# Altium project GB-Drone_master.PrjPcb
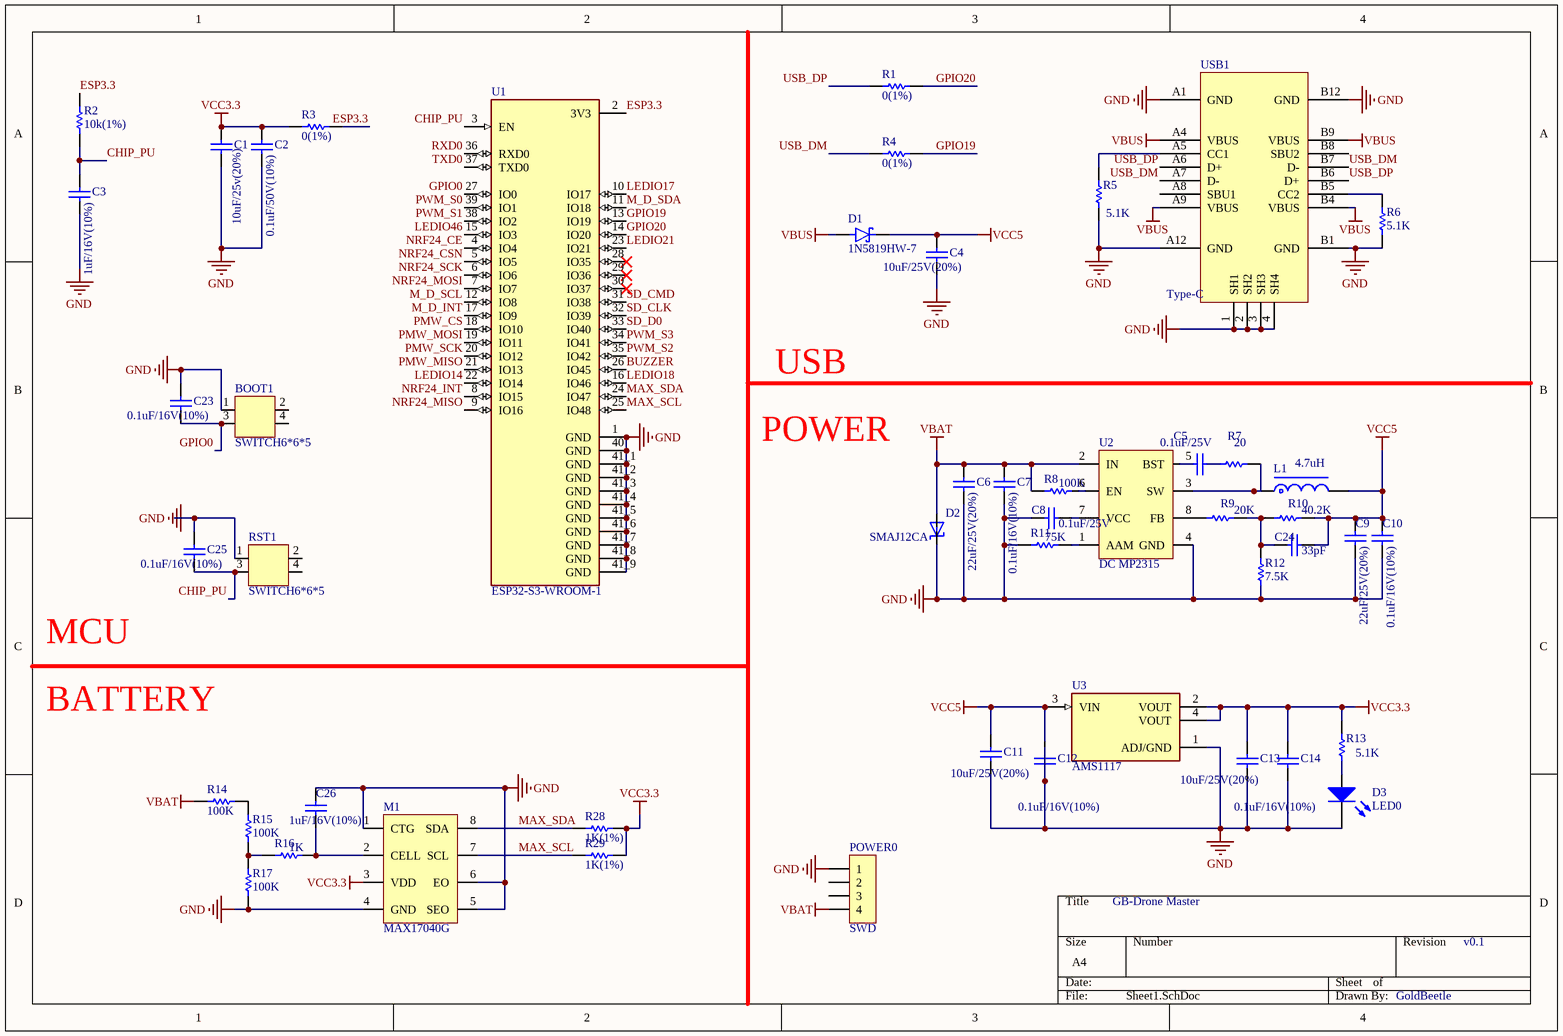
[diagram p0: Sheet1.SchDoc]
2 sheets, 82 parts. Net scope: global (net labels, ports and power ports of the same name join across sheets).
Board file: PCB1.PcbDoc
Sheets:
  Sheet1.SchDoc
  Sheet2.SchDoc

## Sheet Sheet1.SchDoc
size A4; SheetNumber: 1; SheetTotal: 2

### Parts
BOOT1  SWITCH6*6*5
C1  10uF/25v(20%)  [C0805]
C2  0.1uF/50V(10%)  [C0805]
C3  value 1uF/16V(10%)  [C0805]  (hidden comment: 0.1uF/50V(10%))
C4  10uF/25V(20%)  [C0805]
C5  0.1uF/25V  [C0805]
C6  22uF/25V(20%)  [C0805]
C7  0.1uF/16V(10%)  [C0805]
C8  0.1uF/25V  [C0805]
C9  22uF/25V(20%)  [C0805]
C10  0.1uF/16V(10%)  [C0805]
C11  10uF/25V(20%)  [C0805]
C12  0.1uF/16V(10%)  [C0805]
C13  10uF/25V(20%)  [C0805]
C14  0.1uF/16V(10%)  [C0805]
C23  0.1uF/16V(10%)  [C0805]
C24  33pF  [C0805]
C25  0.1uF/16V(10%)  [C0805]
C26  1uF/16V(10%)  [C0805]
D1  1N5819HW-7  [SOD3715X145N]
D2  SMAJ12CA  [DO-214AC]
D3  LED0  [C0805]
L1  4.7uH  [C0805]
M1  MAX17040G  [SON50P200X300X80-9N(MAX27040G+T)]
POWER0  SWD  [XH2.54-4P]
R1  0(1%)  [C0805]
R2  10k(1%)  [C0805]
R3  0(1%)  [C0805]
R4  0(1%)  [C0805]
R5  5.1K  [C0805]
R6  5.1K  [C0805]
R7  20  [C0805]
R8  100K  [C0805]
R9  20K  [C0805]
R10  40.2K  [C0805]
R11  75K  [C0805]
R12  7.5K  [C0805]
R13  5.1K  [C0805]
R14  100K  [C0805]
R15  100K  [C0805]
R16  1K  [C0805]
R17  100K  [C0805]
R28  1K(1%)  [C0805]
R29  1K(1%)  [C0805]
RST1  SWITCH6*6*5
U1  ESP32-S3-WROOM-1  [ESP32-S3-WROOM-1-N16R8]
U2  DC MP2315  [SOT23-8L]
U3  AMS1117  [SOT229P700X180-4N]
USB1  Type-C  [Type-C-TOP]

### Nets
ESP3.3: R2.2 R3.2 U1.2(3V3)
GND: BOOT1.1 C1.1 C2.1 C3.1 C4.1 C6.1 C7.1 C8.1 C9.1 C10.1 C11.1 C12.1 C13.1 C14.1 C23.1 C25.1 C26.2 D2.C D3.2(K) M1.1(CTG) M1.4(GND) M1.5(SEO) M1.6(EO) POWER0.1 R5.1 R6.1 R11.1 R12.2 R17.1 RST1.1 U1.1(GND) U1.40(GND) U1.41_1(GND) U1.41_2(GND) U1.41_3(GND) U1.41_4(GND) U1.41_5(GND) U1.41_6(GND) U1.41_7(GND) U1.41_8(GND) U1.41_9(GND) U2.4(GND) U3.1(ADJ/GND) USB1.1(SH1) USB1.2(SH2) USB1.3(SH3) USB1.4(SH4) USB1.A1(GND) USB1.A12(GND) USB1.B1(GND) USB1.B12(GND)
VBAT: C6.2 C7.2 D2.A POWER0.4 R8.1 R14.2 U2.2(IN)
VBUS: D1.A USB1.A4(VBUS) USB1.A9(VBUS) USB1.B4(VBUS) USB1.B9(VBUS)
VCC3.3: C1.2 C2.2 C13.2 C14.2 M1.3(VDD) R3.1 R13.1 R28.2 R29.2 U3.2(VOUT) U3.4(VOUT)
VCC5: C4.2 C9.2 C10.2 C11.2 C12.2 C24.2 D1.C(K) L1.2 R10.2 U3.3(VIN)
BUZZER: U1.26(IO45)
CHIP_PU: C3.2 C25.2 R2.1 RST1.3 U1.3(EN)
GPIO0: BOOT1.3 C23.2 U1.27(IO0)
GPIO19: R4.2 U1.13(IO19)
GPIO20: R1.2 U1.14(IO20)
LEDIO14: U1.22(IO14)
LEDIO17: U1.10(IO17)
LEDIO18: U1.16(IO46)
LEDIO21: U1.23(IO21)
LEDIO46: U1.15(IO3)
M_D_INT: U1.17(IO9)
M_D_SCL: U1.12(IO8)
M_D_SDA: U1.11(IO18)
MAX_SCL: M1.7(SCL) R29.1 U1.25(IO48)
MAX_SDA: M1.8(SDA) R28.1 U1.24(IO47)
NRF24_CE: U1.4(IO4)
NRF24_CSN: U1.5(IO5)
NRF24_INT: U1.8(IO15)
NRF24_MISO: U1.9(IO16)
NRF24_MOSI: U1.7(IO7)
NRF24_SCK: U1.6(IO6)
PMW_CS: U1.18(IO10)
PMW_MISO: U1.21(IO13)
PMW_MOSI: U1.19(IO11)
PMW_SCK: U1.20(IO12)
PWM_S0: U1.39(IO1)
PWM_S1: U1.38(IO2)
PWM_S2: U1.35(IO42)
PWM_S3: U1.34(IO41)
RXD0: U1.36(RXD0)
SD_CLK: U1.32(IO39)
SD_CMD: U1.31(IO38)
SD_D0: U1.33(IO40)
TXD0: U1.37(TXD0)
USB_DM: R4.1 USB1.A7(D-) USB1.B7(D-)
USB_DP: R1.1 USB1.A6(D+) USB1.B6(D+)
NetC5_1: C5.1 U2.5(BST)
NetC5_2: C5.2 R7.1
NetC8_2: C8.2 U2.7(VCC)
NetC24_1: C24.1 R9.2 R10.1 R12.1
NetC26_1: C26.1 M1.2(CELL) R16.2
NetD3_1: D3.1(A) R13.2
NetL1_1: L1.1 R7.2 U2.3(SW)
NetR5_2: R5.2 USB1.A5(CC1)
NetR6_2: R6.2 USB1.B5(CC2)
NetR8_2: R8.2 U2.6(EN)
NetR9_1: R9.1 U2.8(FB)
NetR11_2: R11.2 U2.1(AAM)
NetR14_1: R14.1 R15.2
NetR15_1: R15.1 R16.1 R17.2

Not connected (* = marked no-connect by the designer): BOOT1 2 4; POWER0 2 3; RST1 2 4; U1 28(IO35)* 29(IO36)* 30(IO37)*; USB1 A8(SBU1) B8(SBU2)

### Notes on the sheet
- USB
- POWER
- MCU
- BATTERY
- GB-Drone Master
- v0.1
- GoldBeetle

### Library data of the parts
C1-C14 C23-C26 = Cap: Capacitor; Published: 8-Jun-2000; LatestRevisionDate: 17-Jul-2002; LatestRevisionNote: Re-released for DXP Platform.; PackageReference: RAD-0.3; Publisher: Altium Limited; PackageDescription: Radial Cap, Thru-Hole; 2 Leads; 0.3 in Pin Spacing
  C1: Value: 10uF/25v(20%)
  C2: Value: 0.1uF/50V(10%)
D1 = 1N5819HW-7: Diode Schottky 40 V 1A Surface Mount SOD-123; MF: Diodes Inc.; SnapEDA_Link: https://www.snapeda.com/parts/1N5819HW-7/Diodes+Inc./view-part/?ref=snap; Price: None; Check_prices: https://www.snapeda.com/parts/1N5819HW-7/Diodes+Inc./view-part/?ref=eda; Availability: In Stock; Value: *; MP: 1N5819HW-7; Package: SOD-123 Fairchild Semiconductor; Purchase-URL: https://pricing.snapeda.com/search/part/1N5819HW-7/?ref=eda
D2 = SMAJ12CA: 19.9V Clamp 20.1A Ipp Tvs Diode Surface Mount SMAJ _DO-214AC_; MF: Taiwan Semiconductor; SnapEDA_Link: https://www.snapeda.com/parts/SMAJ12CA/Taiwan%20Semiconductor/view-part/2769109/?ref=snap; Availability: Unavailable; Value: *; MP: SMAJ12CA; Package: DO-214AC-214 Taiwan Semiconductor; Price: None
D3 = LED0: Typical INFRARED GaAs LED; Published: 8-Jun-2000; LatestRevisionDate: 08-Jul-2005; LatestRevisionNote: Mech Layer 1 removed.; PackageReference: LED-0; Publisher: Altium Limited; PackageDescription: LED; 2 Leads
L1 = L-NR: NR功率电感; 版权归属: 源创客; BOM名称: NR功率电感; 学习资源: www.ooocke.com
M1 = MAX17040G: 电量检测
POWER0 = Header 4: 4P接插件; 版权归属: 源创客; BOM名称: 4P接插件; 学习资源: www.ooocke.com
R1-R17 R28 R29 = Res1: Resistor; Published: 8-Jun-2000; LatestRevisionDate: 17-Jul-2002; LatestRevisionNote: Re-released for DXP Platform.; PackageReference: AXIAL-0.3; Publisher: Altium Limited; PackageDescription: Axial Device, Thru-Hole; 2 Leads; 0.3 in Pin Spacing
U1 = ESP32-S3-WROOM-1: Bluetooth, WiFi 802.11b/g/n, Bluetooth v5.0 Transceiver Module 2.4GHz PCB Trace Surface Mount; MP: ESP32-S3-WROOM-1-N8R8; MF: Espressif Systems; Price: None; Availability: In Stock; Package: None; Value: *; SnapEDA_Link: https://www.snapeda.com/parts/ESP32-S3-WROOM-1-N8R8/Espressif+Systems/view-part/?ref=snap; Check_prices: https://www.snapeda.com/parts/ESP32-S3-WROOM-1-N8R8/Espressif+Systems/view-part/?ref=eda; Purchase-URL: https://pricing.snapeda.com/search/part/ESP32-S3-WROOM-1-N8R8/?ref=eda
U2 = DC MP2315: DC降压芯片
U3 = AMS1117: UNO PLUS Arduino R3 Shield, Xbee Arduino IDE Wheeled Robotics Kit; MF: Seeed Technology; Availability: Unavailable; SnapEDA_Link: https://www.snapeda.com/parts/AMS1117/Seeed%20Technology%20Co.%2C%20Ltd/view-part/184428/?ref=snap; MP: AMS1117; Price: None; Value: *; Package: SOT-223 Seeed Technology
USB1 = USB-Type-C-TOP

## Sheet Sheet2.SchDoc
size A4; SheetNumber: 2; SheetTotal: 2
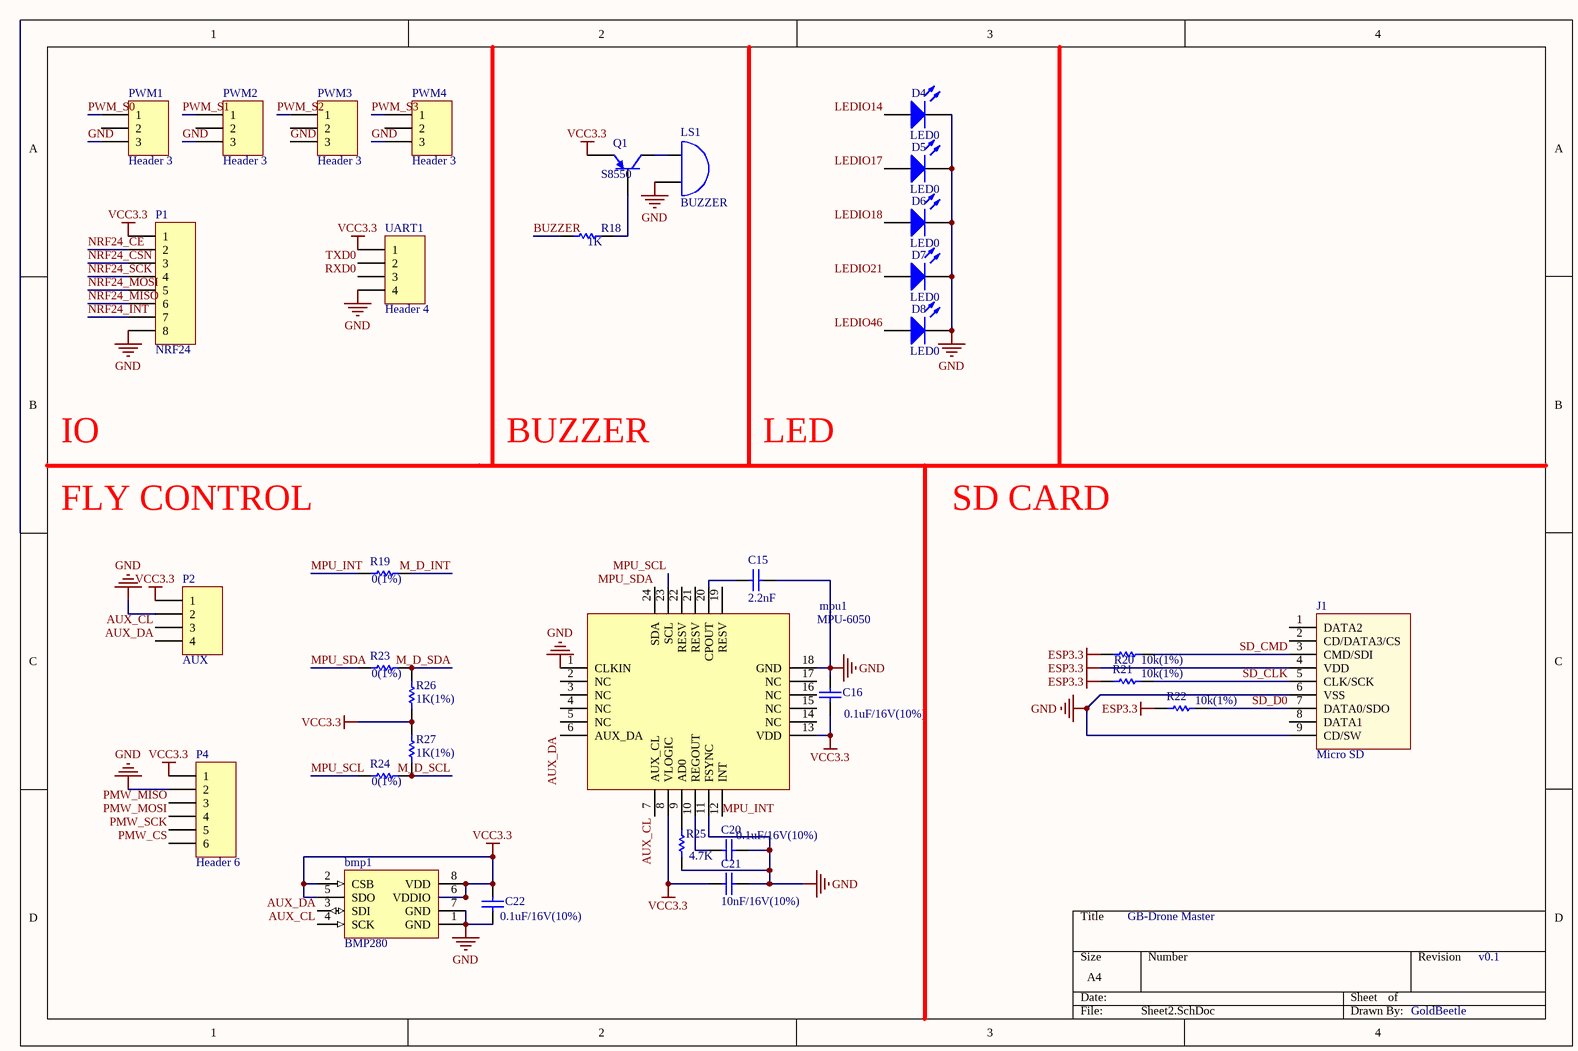
[diagram p1: Sheet2.SchDoc]

### Parts
bmp1  BMP280  [BMP280 LGA8]
C15  2.2nF  [C0805]
C16  0.1uF/16V(10%)  [C0805]
C20  0.1uF/16V(10%)  [C0805]
C21  10nF/16V(10%)  [C0805]
C22  0.1uF/16V(10%)  [C0805]
D4  LED0  [C0805]
D5  LED0  [C0805]
D6  LED0  [C0805]
D7  LED0  [C0805]
D8  LED0  [C0805]
J1  Micro SD  [Micro SD]
LS1  BUZZER  [Beeper]
mpu1  MPU-6050  [QFN24 4X4_N]
P1  NRF24  [NRF24_line]
P2  AUX  [XH2.54-4P]
P4  Header 6  [XH2.54-6P]
PWM1  Header 3  [HDR1X3]
PWM2  Header 3  [HDR1X3]
PWM3  Header 3  [HDR1X3]
PWM4  Header 3  [HDR1X3]
Q1  S8550  [SOT-23B_N]
R18  1K  [C0805]
R19  0(1%)  [C0805]
R20  10k(1%)  [C0805]
R21  10k(1%)  [C0805]
R22  10k(1%)  [C0805]
R23  0(1%)  [C0805]
R24  0(1%)  [C0805]
R25  4.7K  [C0805]
R26  1K(1%)  [C0805]
R27  1K(1%)  [C0805]
UART1  Header 4  [HDR1X4]

### Nets
ESP3.3: J1.4(VDD) R20.2 R21.2 R22.2
GND: bmp1.1(GND) bmp1.7(GND) C15.1 C16.1 C20.1 C21.1 C22.2 D4.2(K) D5.2(K) D6.2(K) D7.2(K) D8.2(K) J1.6(VSS) J1.9(CD/SW) LS1.2(B) mpu1.1(CLKIN) mpu1.11(FSYNC) mpu1.18(GND) P1.8 P2.2 P4.2 PWM1.3 PWM2.3 PWM3.3 PWM4.3 R25.2 UART1.4
VCC3.3: bmp1.2(CSB) bmp1.5(SDO) bmp1.6(VDDIO) bmp1.8(VDD) C16.2 C21.2 C22.1 mpu1.8(VLOGIC) mpu1.13(VDD) P1.1 P2.1 P4.1 Q1.2(E) R26.1 R27.2 UART1.1
AUX_CL: bmp1.4(SCK) mpu1.7(AUX_CL) P2.3
AUX_DA: bmp1.3(SDI) mpu1.6(AUX_DA) P2.4
BUZZER: R18.1
LEDIO14: D4.1(A)
LEDIO17: D5.1(A)
LEDIO18: D6.1(A)
LEDIO21: D7.1(A)
LEDIO46: D8.1(A)
M_D_INT: R19.2
M_D_SCL: R24.2 R27.1
M_D_SDA: R23.2 R26.2
MPU_INT: mpu1.12(INT) R19.1
MPU_SCL: mpu1.23(SCL) R24.1
MPU_SDA: mpu1.24(SDA) R23.1
NRF24_CE: P1.2
NRF24_CSN: P1.3
NRF24_INT: P1.7
NRF24_MISO: P1.6
NRF24_MOSI: P1.5
NRF24_SCK: P1.4
PMW_CS: P4.6
PMW_MISO: P4.3
PMW_MOSI: P4.4
PMW_SCK: P4.5
PWM_S0: PWM1.1
PWM_S1: PWM2.1
PWM_S2: PWM3.1
PWM_S3: PWM4.1
RXD0: UART1.3
SD_CLK: J1.5(CLK/SCK) R21.1
SD_CMD: J1.3(CMD/SDI) R20.1
SD_D0: J1.7(DATA0/SDO) R22.1
TXD0: UART1.2
NetC15_2: C15.2 mpu1.20(CPOUT)
NetC20_2: C20.2 mpu1.10(REGOUT)
NetLS1_1: LS1.1(A) Q1.3(C)
Netmpu1_9: mpu1.9(AD0) R25.1
NetQ1_1: Q1.1(B) R18.2

Not connected (* = marked no-connect by the designer): J1 1(DATA2) 2(CD/DATA3/CS) 8(DATA1); mpu1 2(NC) 3(NC) 4(NC) 5(NC) 14(NC) 15(NC) 16(NC) 17(NC) 19(RESV) 21(RESV) 22(RESV); PWM1 2; PWM2 2; PWM3 2; PWM4 2

### Notes on the sheet
- IO
- BUZZER
- LED
- FLY CONTROL
- SD CARD
- GB-Drone Master
- v0.1
- GoldBeetle

### Library data of the parts
bmp1 = BMP280: 气压传感器
C15 C16 C20-C22 = Cap: Capacitor; Published: 8-Jun-2000; LatestRevisionDate: 17-Jul-2002; LatestRevisionNote: Re-released for DXP Platform.; PackageReference: RAD-0.3; Publisher: Altium Limited; PackageDescription: Radial Cap, Thru-Hole; 2 Leads; 0.3 in Pin Spacing
D4-D8 = LED0: Typical INFRARED GaAs LED; Published: 8-Jun-2000; LatestRevisionDate: 08-Jul-2005; LatestRevisionNote: Mech Layer 1 removed.; PackageReference: LED-0; Publisher: Altium Limited; PackageDescription: LED; 2 Leads
J1 = Micro SD: Micro SD卡; 版权归属: 源创客; BOM名称: Micro SD卡; 学习资源: www.ooocke.com
LS1 = Bell: Electrical Bell; Published: 24-Mar-1999; LatestRevisionDate: 17-Jul-2002; LatestRevisionNote: Re-released for DXP Platform.; PackageReference: PIN2; Publisher: Altium Limited
mpu1 = MPU-6050: 传感器; ComponentLink1Description: 供应商链接; ComponentLink1URL: http://www.szlcsc.com/product/details_24852.html; Package: QFN-24_4x4x05P; Supplier: LC; SuppliersPartNumber: C24112
P1 = Header 8: Header, 8-Pin; LatestRevisionDate: 17-Jul-2002; LatestRevisionNote: Re-released for DXP Platform.; Publisher: Altium Limited
P2 UART1 = Header 4: Header, 4-Pin; LatestRevisionDate: 17-Jul-2002; LatestRevisionNote: Re-released for DXP Platform.; Publisher: Altium Limited
P4 = Header 6: Header, 6-Pin; LatestRevisionDate: 17-Jul-2002; LatestRevisionNote: Re-released for DXP Platform.; Publisher: Altium Limited
PWM1-PWM4 = Header 3: Header, 3-Pin; LatestRevisionDate: 17-Jul-2002; LatestRevisionNote: Re-released for DXP Platform.; Publisher: Altium Limited
Q1 = PNP: PNP Bipolar Transistor; Published: 8-Jun-2000; LatestRevisionDate: 29-May-2009; LatestRevisionNote: IPC-7351 Footprint Added.; PackageVersion: Aug-1999; PackageReference: SOT-23B; Publisher: Altium Limited; PackageDescription: 3-Pin SOT-23 Package 0.95 mm Pitch, 2.4 mm Lead Span
R18-R27 = Res1: Resistor; Published: 8-Jun-2000; LatestRevisionDate: 17-Jul-2002; LatestRevisionNote: Re-released for DXP Platform.; PackageReference: AXIAL-0.3; Publisher: Altium Limited; PackageDescription: Axial Device, Thru-Hole; 2 Leads; 0.3 in Pin Spacing

## Nets that join several sheets
ESP3.3: Sheet1 (R2.2 R3.2 U1.2), Sheet2 (J1.4 R20.2 R21.2 R22.2)
GND: Sheet1 (51 pins), Sheet2 (27 pins)
VCC3.3: Sheet1 (11 pins), Sheet2 (16 pins)
BUZZER: Sheet1 (U1.26), Sheet2 (R18.1)
LEDIO14: Sheet1 (U1.22), Sheet2 (D4.1)
LEDIO17: Sheet1 (U1.10), Sheet2 (D5.1)
LEDIO18: Sheet1 (U1.16), Sheet2 (D6.1)
LEDIO21: Sheet1 (U1.23), Sheet2 (D7.1)
LEDIO46: Sheet1 (U1.15), Sheet2 (D8.1)
M_D_INT: Sheet1 (U1.17), Sheet2 (R19.2)
M_D_SCL: Sheet1 (U1.12), Sheet2 (R24.2 R27.1)
M_D_SDA: Sheet1 (U1.11), Sheet2 (R23.2 R26.2)
NRF24_CE: Sheet1 (U1.4), Sheet2 (P1.2)
NRF24_CSN: Sheet1 (U1.5), Sheet2 (P1.3)
NRF24_INT: Sheet1 (U1.8), Sheet2 (P1.7)
NRF24_MISO: Sheet1 (U1.9), Sheet2 (P1.6)
NRF24_MOSI: Sheet1 (U1.7), Sheet2 (P1.5)
NRF24_SCK: Sheet1 (U1.6), Sheet2 (P1.4)
PMW_CS: Sheet1 (U1.18), Sheet2 (P4.6)
PMW_MISO: Sheet1 (U1.21), Sheet2 (P4.3)
PMW_MOSI: Sheet1 (U1.19), Sheet2 (P4.4)
PMW_SCK: Sheet1 (U1.20), Sheet2 (P4.5)
PWM_S0: Sheet1 (U1.39), Sheet2 (PWM1.1)
PWM_S1: Sheet1 (U1.38), Sheet2 (PWM2.1)
PWM_S2: Sheet1 (U1.35), Sheet2 (PWM3.1)
PWM_S3: Sheet1 (U1.34), Sheet2 (PWM4.1)
RXD0: Sheet1 (U1.36), Sheet2 (UART1.3)
SD_CLK: Sheet1 (U1.32), Sheet2 (J1.5 R21.1)
SD_CMD: Sheet1 (U1.31), Sheet2 (J1.3 R20.1)
SD_D0: Sheet1 (U1.33), Sheet2 (J1.7 R22.1)
TXD0: Sheet1 (U1.37), Sheet2 (UART1.2)